# Altium schematic sheet Audio_Codec_Analog_FrontEnd.SchDoc
size 558 x 330 mm; SheetNumber: 1; SheetTotal: 3
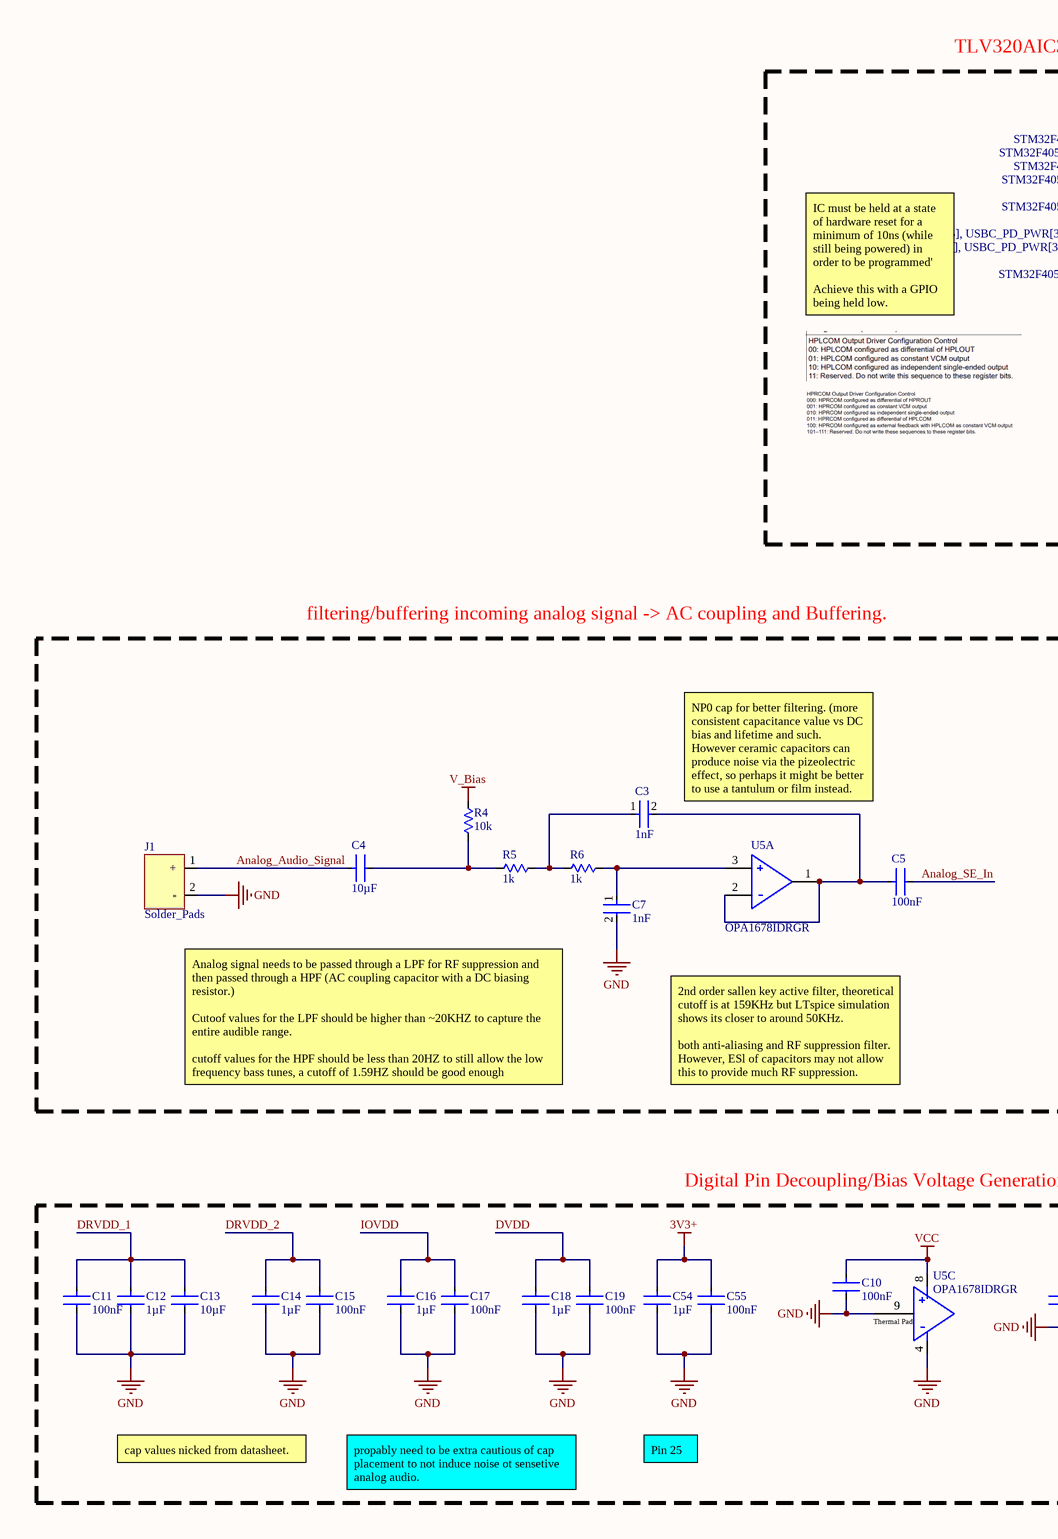
[diagram p0: Audio_Codec_Analog_FrontEnd.SchDoc, left]
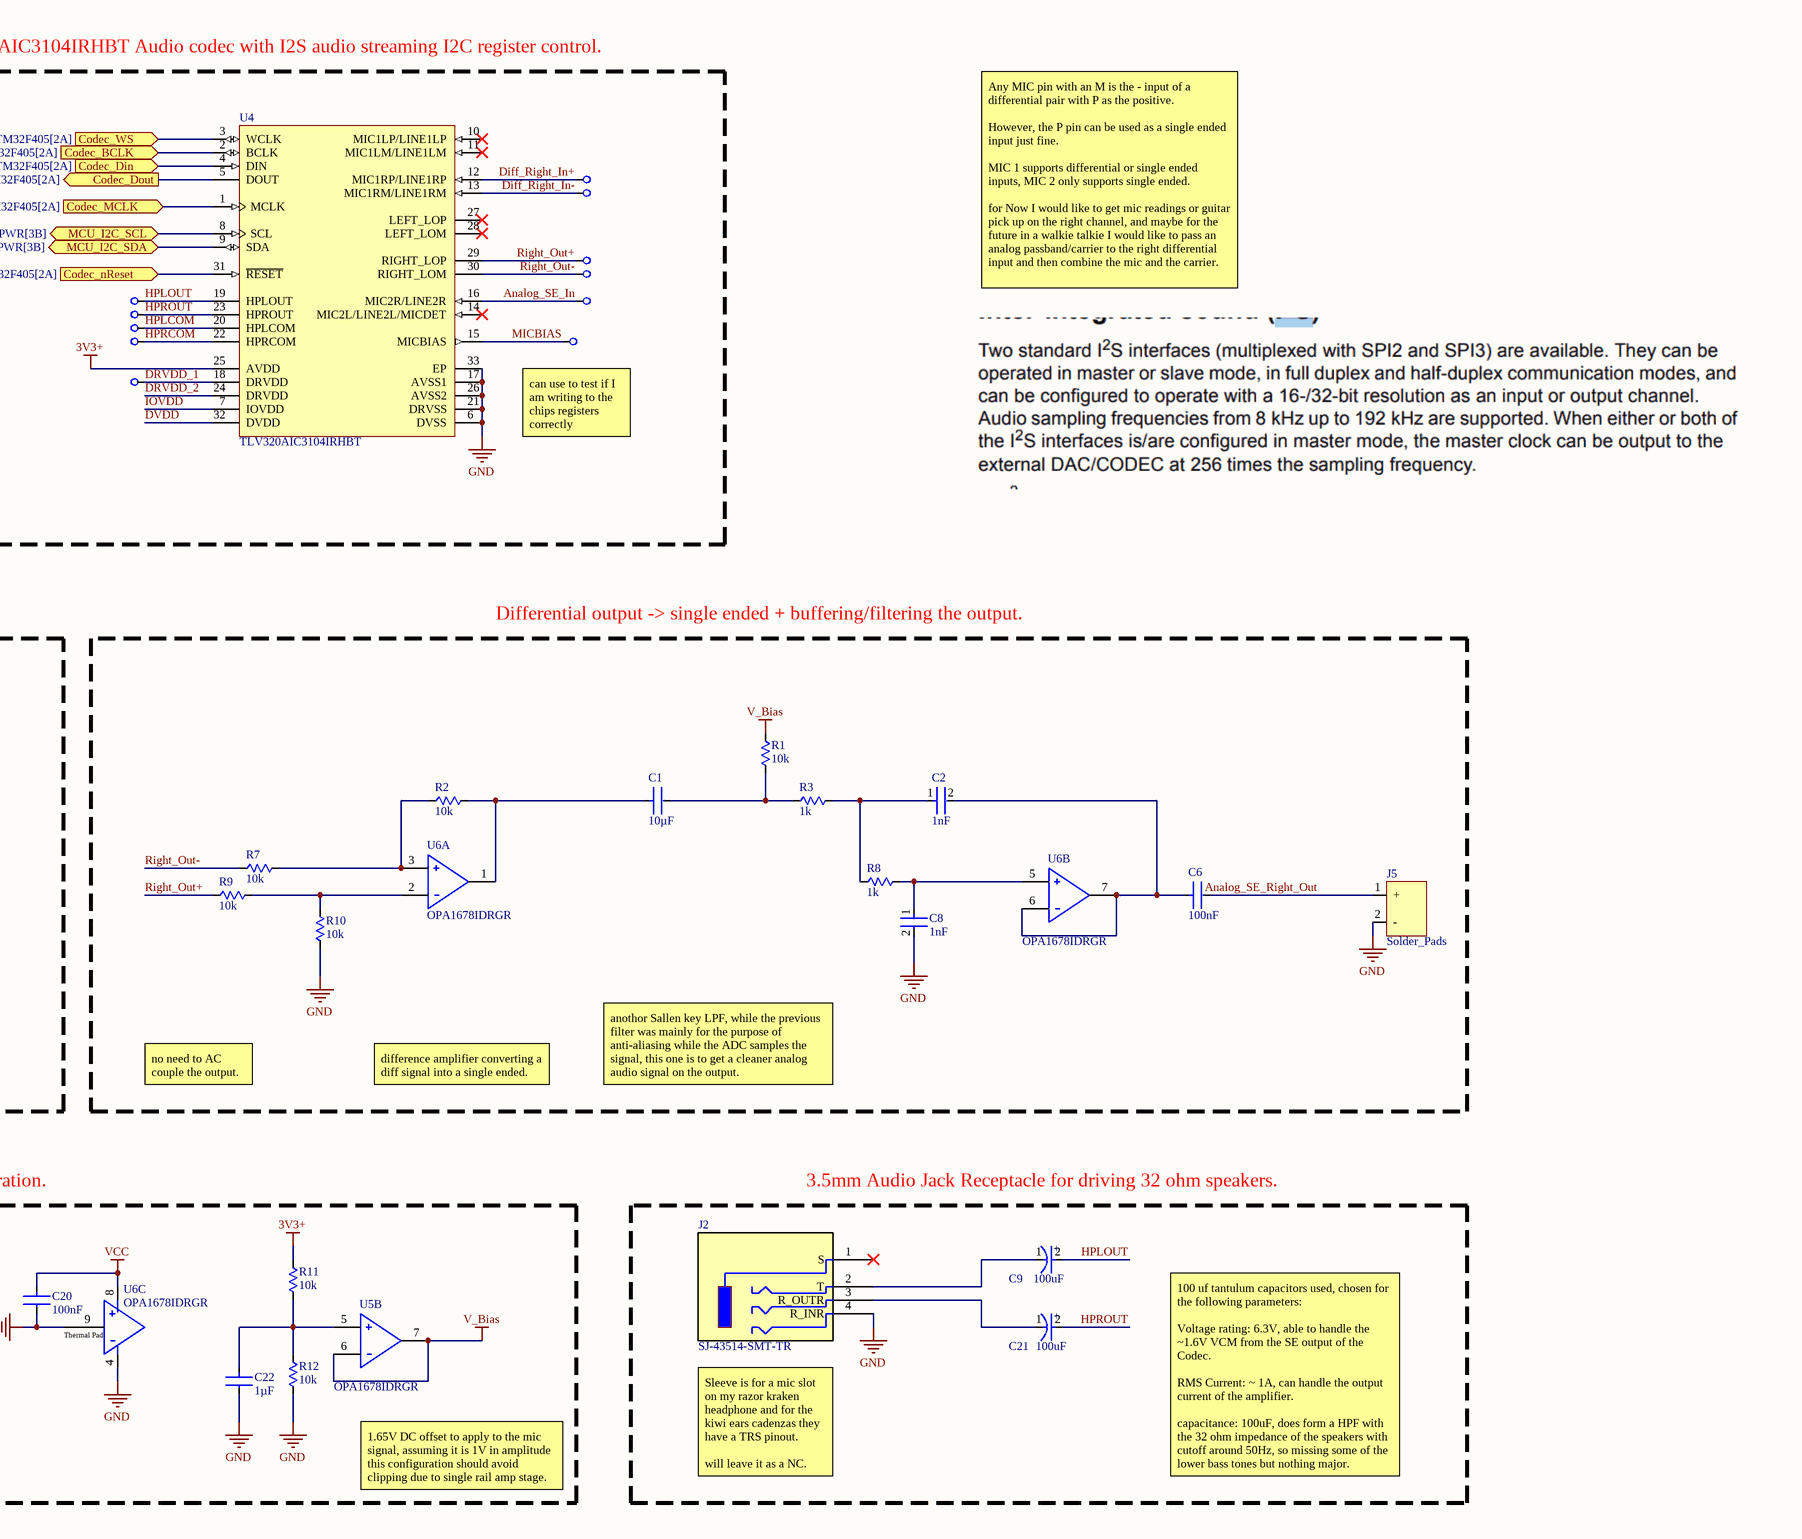
[diagram p1: Audio_Codec_Analog_FrontEnd.SchDoc, right]

## Parts
C1  value 10µF  [MURATA-G_M21B]  (hidden comment: GCM21BC71E106KE36L)
C2  1nF  [FP-GRM188-0_1-e0_2_0_5-IPC_C]
C3  1nF  [FP-GRM188-0_1-e0_2_0_5-IPC_C]
C4  value 10µF  [MURATA-G_M21B]  (hidden comment: GCM21BC71E106KE36L)
C5  value 100nF  [MURATA-G_M188]  (hidden comment: GCM188R71H104KA57D)
C6  value 100nF  [MURATA-G_M188]  (hidden comment: GCM188R71H104KA57D)
C7  1nF  [FP-GRM188-0_1-e0_2_0_5-IPC_C]
C8  1nF  [FP-GRM188-0_1-e0_2_0_5-IPC_C]
C9  Capacitance: 100uF  [FP-TAJB-MFG]  (hidden comment: TAJB107M006RNJ)
C10  value 100nF  [MURATA-G_M188]  (hidden comment: GCM188R71H104KA57D)
C11  value 100nF  [MURATA-G_M188]  (hidden comment: GCM188R71H104KA57D)
C12  value 1µF  [MURATA-G_M188]  (hidden comment: GCM188R71E105KA64D)
C13  value 10µF  [MURATA-G_M21B]  (hidden comment: GCM21BC71E106KE36L)
C14  value 1µF  [MURATA-G_M188]  (hidden comment: GCM188R71E105KA64D)
C15  value 100nF  [MURATA-G_M188]  (hidden comment: GCM188R71H104KA57D)
C16  value 1µF  [MURATA-G_M188]  (hidden comment: GCM188R71E105KA64D)
C17  value 100nF  [MURATA-G_M188]  (hidden comment: GCM188R71H104KA57D)
C18  value 1µF  [MURATA-G_M188]  (hidden comment: GCM188R71E105KA64D)
C19  value 100nF  [MURATA-G_M188]  (hidden comment: GCM188R71H104KA57D)
C20  value 100nF  [MURATA-G_M188]  (hidden comment: GCM188R71H104KA57D)
C21  Capacitance: 100uF  [FP-TAJB-MFG]  (hidden comment: TAJB107M006RNJ)
C22  value 1µF  [MURATA-G_M188]  (hidden comment: GCM188R71E105KA64D)
C54  value 1µF  [MURATA-G_M188]  (hidden comment: GCM188R71E105KA64D)
C55  value 100nF  [MURATA-G_M188]  (hidden comment: GCM188R71H104KA57D)
J1  Solder_Pads  [2_soldering_pads]
J2  SJ-43514-SMT-TR  [SJ-43514-SMT_CUD]
J5  Solder_Pads  [2_soldering_pads]
R1  value 10k  [VISHAY-CRCW0603]  (hidden comment: CRCW060310K0FKTA)
R2  value 10k  [VISHAY-CRCW0603]  (hidden comment: CRCW060310K0FKTA)
R3  value 1k  [VISHAY-TNPW0603]  (hidden comment: TNPW06031K00BEEA)
R4  value 10k  [VISHAY-CRCW0603]  (hidden comment: CRCW060310K0FKTA)
R5  value 1k  [VISHAY-TNPW0603]  (hidden comment: TNPW06031K00BEEA)
R6  value 1k  [VISHAY-TNPW0603]  (hidden comment: TNPW06031K00BEEA)
R7  value 10k  [VISHAY-CRCW0603]  (hidden comment: CRCW060310K0FKTA)
R8  value 1k  [VISHAY-TNPW0603]  (hidden comment: TNPW06031K00BEEA)
R9  value 10k  [VISHAY-CRCW0603]  (hidden comment: CRCW060310K0FKTA)
R10  value 10k  [VISHAY-CRCW0603]  (hidden comment: CRCW060310K0FKTA)
R11  value 10k  [VISHAY-CRCW0603]  (hidden comment: CRCW060310K0FKTA)
R12  value 10k  [VISHAY-CRCW0603]  (hidden comment: CRCW060310K0FKTA)
TP1  Testpoint 1mm  [Testpoint 1mm]  (value not drawn)
TP2  Testpoint 1mm  [Testpoint 1mm]  (value not drawn)
TP3  Testpoint 1mm  [Testpoint 1mm]  (value not drawn)
TP4  Testpoint 1mm  [Testpoint 1mm]  (value not drawn)
TP5  Testpoint 1mm  [Testpoint 1mm]  (value not drawn)
TP6  Testpoint 1mm  [Testpoint 1mm]  (value not drawn)
TP7  Testpoint 1mm  [Testpoint 1mm]  (value not drawn)
TP8  Testpoint 1mm  [Testpoint 1mm]  (value not drawn)
TP9  Testpoint 1mm  [Testpoint 1mm]  (value not drawn)
TP25  Testpoint 1mm  [Testpoint 1mm]  (value not drawn)
TP26  Testpoint 1mm  [Testpoint 1mm]  (value not drawn)
U4  TLV320AIC3104IRHBT  [RHB0032E_V]
U5  OPA1678IDRGR  [FP-DRG0008A-IPC_B]  (parts A,B,C of 3)
U6  OPA1678IDRGR  [FP-DRG0008A-IPC_B]  (parts A,B,C of 3)

## Blocks framed on the sheet
Digital Pin Decoupling/Bias Voltage Generation.: C10-C20 C22 C54 C55 R11 R12 U5 U6
3.5mm Audio Jack Receptacle for driving 32 ohm speakers.: C9 C21 J2

## Ports
Codec_BCLK (in, see STM32F405[2A]), Codec_Din (in, see STM32F405[2A]), Codec_Dout (out, see STM32F405[2A]), Codec_MCLK (in, see STM32F405[2A]), Codec_nReset (in, see STM32F405[2A]), Codec_WS (in, see STM32F405[2A]), MCU_I2C_SCL (bidir, see STM32F405[2B], USBC_PD_PWR[3B]), MCU_I2C_SDA (bidir, see STM32F405[2B], USBC_PD_PWR[3B])

## Nets
3V3+: C54.1 C55.1 R11.2 U4.25(AVDD)
GND: C7.2 C8.2 C10.2 C11.2 C12.2 C13.2 C14.2 C15.2 C16.2 C17.2 C18.2 C19.2 C20.2 C22.2 C54.2 C55.2 J1.2(-) J2.4(R_INR) J5.2(-) R10.2 R12.1 U4.6(DVSS) U4.17(AVSS1) U4.21(DRVSS) U4.26(AVSS2) U4.33(EP) U5.4(OUT_B) U5.9(Thermal_Pad) U6.4(OUT_B) U6.9(Thermal_Pad)
V_Bias: R1.2 R4.2 U5.6(-IN_B) U5.7(OUT_B)
VCC: C10.1 C20.1 U5.8(OUT_B) U6.8(OUT_B)
Analog_Audio_Signal: C4.1 J1.1(+)
Analog_SE_In: C5.2 TP6.1 U4.16(MIC2R/LINE2R)
Analog_SE_Right_Out: C6.2 J5.1(+)
Codec_BCLK: U4.2(BCLK) ; port Codec_BCLK
Codec_Din: U4.4(DIN) ; port Codec_Din
Codec_Dout: U4.5(DOUT) ; port Codec_Dout
Codec_MCLK: U4.1(MCLK) ; port Codec_MCLK
Codec_nReset: U4.31(~{RESET}) ; port Codec_nReset
Codec_WS: U4.3(WCLK) ; port Codec_WS
Diff_Right_In+: TP1.1 U4.12(MIC1RP/LINE1RP)
Diff_Right_In-: TP2.1 U4.13(MIC1RM/LINE1RM)
DRVDD_1: C11.1 C12.1 C13.1 TP9.1 U4.18(DRVDD)
DRVDD_2: C14.1 C15.1 U4.24(DRVDD)
DVDD: C18.1 C19.1 U4.32(DVDD)
HPLCOM: TP25.1 U4.20(HPLCOM)
HPLOUT: C9.2(A) TP5.1 U4.19(HPLOUT)
HPRCOM: TP26.1 U4.22(HPRCOM)
HPROUT: C21.2(A) TP7.1 U4.23(HPROUT)
IOVDD: C16.1 C17.1 U4.7(IOVDD)
MCU_I2C_SCL: U4.8(SCL) ; port MCU_I2C_SCL
MCU_I2C_SDA: U4.9(SDA) ; port MCU_I2C_SDA
MICBIAS: TP8.1 U4.15(MICBIAS)
Right_Out+: R9.2 TP3.1 U4.29(RIGHT_LOP)
Right_Out-: R7.2 TP4.1 U4.30(RIGHT_LOM)
NetC1_1: C1.1 R2.1 U6.1(OUT_B)
NetC1_2: C1.2 R1.1 R3.2
NetC2_1: C2.1 R3.1 R8.2
NetC2_2: C2.2 C6.1 U6.6(-IN_B) U6.7(OUT_B)
NetC3_1: C3.1 R5.1 R6.2
NetC3_2: C3.2 C5.1 U5.1(OUT_B) U5.2(-IN_B)
NetC4_2: C4.2 R4.1 R5.2
NetC7_1: C7.1 R6.1 U5.3(+IN_B)
NetC8_1: C8.1 R8.1 U6.5(+IN_B)
NetC9_1: C9.1(C) J2.2(T)
NetC21_1: C21.1(C) J2.3(R_OUTR)
NetC22_1: C22.1 R11.1 R12.2 U5.5(+IN_B)
NetR2_2: R2.2 R7.1 U6.3(+IN_B)
NetR9_1: R9.1 R10.1 U6.2(-IN_B)

Not connected (* = marked no-connect by the designer): J2 1(S)*; U4 10(MIC1LP/LINE1LP)* 11(MIC1LM/LINE1LM)* 14(MIC2L/LINE2L/MICDET)* 27(LEFT_LOP)* 28(LEFT_LOM)*

## Notes on the sheet
- TLV320AIC3104IRHBT Audio codec with I2S audio streaming I2C register control.
- IC must be held at a state of hardware reset for a minimum of 10ns (while still being powered) in order to be programmed'
  Achieve this with a GPIO being held low.
- Any MIC pin with an M is the - input of a differential pair with P as the positive.
  However, the P pin can be used as a single ended input just fine.
  MIC 1 supports differential or single ended inputs, MIC 2 only supports single ended.
  for Now I would like to get mic readings or guitar pick up on the right channel, and maybe for the future in a walkie talkie I would like to pass an analog passband/carrier to the right differential input and then combine the mic and the carrier.
- (near TP8) can use to test if I am writing to the chips registers correctly
- filtering/buffering incoming analog signal -> AC coupling and Buffering.
- Differential output -> single ended + buffering/filtering the output.
- (near C3) NP0 cap for better filtering. (more consistent capacitance value vs DC bias and lifetime and such.
  However ceramic capacitors can produce noise via the pizeolectric effect, so perhaps it might be better to use a tantulum or film instead.
- Analog signal needs to be passed through a LPF for RF suppression and then passed through a HPF (AC coupling capacitor with a DC biasing resistor.)
  Cutoof values for the LPF should be higher than ~20KHZ to capture the entire audible range.
  cutoff values for the HPF should be less than 20HZ to still allow the low frequency bass tunes, a cutoff of 1.59HZ should be good enough
- 2nd order sallen key active filter, theoretical cutoff is at 159KHz but LTspice simulation shows its closer to around 50KHz.
  both anti-aliasing and RF suppression filter. However, ESl of capacitors may not allow this to provide much RF suppression.
- no need to AC couple the output.
- difference amplifier converting a diff signal into a single ended.
- anothor Sallen key LPF, while the previous filter was mainly for the purpose of anti-aliasing while the ADC samples the signal, this one is to get a cleaner analog audio signal on the output.
- cap values nicked from datasheet.
- Pin 25
- propably need to be extra cautious of cap placement to not induce noise ot sensetive analog audio.
- 1.65V DC offset to apply to the mic signal, assuming it is 1V in amplitude this configuration should avoid clipping due to single rail amp stage.
- Sleeve is for a mic slot on my razor kraken headphone and for the kiwi ears cadenzas they have a TRS pinout.
  will leave it as a NC.
- 100 uf tantulum capacitors used, chosen for the following parameters:
  Voltage rating: 6.3V, able to handle the ~1.6V VCM from the SE output of the Codec.
  RMS Current: ~ 1A, can handle the output current of the amplifier.
  capacitance: 100uF, does form a HPF with the 32 ohm impedance of the speakers with cutoff around 50Hz, so missing some of the lower bass tones but nothing major.
- (in symbol CMP-04424-000592-1) +
- (in symbol CMP-04894-000047-1, part C) Thermal Pad

## Library data of the parts
C1 C4 C13 = CMP-001-02049-3: 10 µF ±10% 25V Ceramic Capacitor X7S 0805 (2012 Metric); Capacitor Type: Ceramic; Mounting Technology: Surface Mount; Min Operating Temperature: 125°C; Case/Package: 0805; Voltage Rating: 25V; Temperature Code: X7S; Tolerance: 10%; Pins: 2; Max Operating Temperature: -55°C
C2 C3 C7 C8 = CMP-1662-00022-2: Chip Multilayer Ceramic Capacitors for General Purpose, 0603, 1000pF, C0G, 30ppm/°C, 5%, 50V; Insulation Resistance: 10GR; Number of Pins: 2; REACH SVHC: No SVHC; Width: 0.8mm; Tolerance: 5%; Termination: SMD/SMT; Thickness: 0.035inch; Height: 0.8mm; Case Code (Imperial): 0603; Length: 1.6mm; Voltage Rating: 50V; Voltage Rating (DC): 50V; Temperature Coefficient: 30ppm/°C; Capacitance: 1nF; Mount: Surface Mount; Lead Free: Lead Free; Max Operating Temperature: 125°C; Min Operating Temperature: -55°C; Packaging: Tape and Reel; Dielectric: C0G; Voltage: 50V; Package Quantity: 1; Material: Ceramic; Case Code (Metric): 1608; Radiation Hardening: No; Depth: 0.8mm; Case/Package: 0603; Dielectric Material: Ceramic
C5 C6 C10 C11 C15 C17 C19 C20 C55 = CMP-001-00243-4: 0.1 µF ±10% 50V Ceramic Capacitor X7R 0603 (1608 Metric); Pins: 2; Temperature Code: X7R; Mounting Technology: Surface Mount; Capacitor Type: Ceramic; Case/Package: 0603; RoHS Compliant: Yes; Tolerance: 10%; Voltage Rating: 50V
C9 C21 = CMP-04424-000592-1: 100uF 6.3V  ±20% 1.7Ω 1210  SMD Tantalum Capacitor; ESR (Equivalent Series Resistance): 1.7R; Leakage Current: 6.3uA; Polarity: Polar; Dissipation Factor: 10%; Termination: SMD/SMT; Max Operating Temperature: 125°C; RoHS Compliant: Yes; Features: General Purpose; Voltage Rating (DC): 6.3V; Width: 2.8mm; Construction: Flat; Length: 3.5mm; Height: 2.1mm; Min Operating Temperature: -55°C; Tolerance: 20%; Lead Free: Lead Free; Mount: Surface Mount; Voltage Rating: 6.3V; Package Quantity: 1; Packaging: Tape and Reel; Case/Package: 1210; Case Code (Imperial): 1210; Depth: 2.8mm; Case Code (Metric): 3528; Series: TAJ; Number of Pins: 2; REACH SVHC: No SVHC; Radiation Hardening: No; Height - Seated (Max): 0.083inch
C12 C14 C16 C18 C22 C54 = CMP-001-00230-4: 1 µF ±10% 25V Ceramic Capacitor X7R 0603 (1608 Metric); Tolerance: 10%; Mounting Technology: Surface Mount; Temperature Code: X7R; Case/Package: 0603; RoHS Compliant: Yes; Pins: 2; Capacitor Type: Ceramic; Voltage Rating: 25V
J2 = SJ-43514-SMT-TR: Description; Manufacturer_Name: Same Sky; Copyright: Copyright (C) 2025 Ultra Librarian. All rights reserved.; Manufacturer_Part_Number: SJ-43514-SMT-TR; RefDes: RefDes; Type: Type
R1 R2 R4 R7 R9-R12 = CMP-009-00002-7: 10 kOhms ±1% 0.1W, 1/10W Chip Resistor 0603 (1608 Metric) Automotive AEC-Q200 Thick Film; Power: 100mW; Voltage Rating: 75V; Max Operating Temperature: 155°C; Pins: 2; Min Operating Temperature: -55°C; RoHS Compliant: No; Tolerance: 1%; Case/Package: 0603; Mounting Technology: Surface Mount
R3 R5 R6 R8 = CMP-009-00212-3: 1 kOhms ±0.1% 0.21W Chip Resistor 0603 (1608 Metric) Anti-Sulfur, Automotive AEC-Q200, Moisture Resistant Thin Film; Voltage Rating: 100V; Power: 100mW; Pins: 2; Mounting Technology: Surface Mount; Tolerance: 0.1%; Case/Package: 0603; Max Operating Temperature: 125°C; RoHS Compliant: Yes; Min Operating Temperature: -55°C
TP1-TP9 TP25 TP26 = CMP-00030-00004-4: Labelled 1mm testpoint pad
U4 = CMP-0331-00065-2: Low-Power Stereo CODEC with 6 Inputs, 6 Outputs, HP Amp and Enhanced Digital Effects, 2 ADCs and 2 DACs, 102 dB DAC SNR, -40 to 85 degC, 32-pin QFN (RHB), Green (RoHS & no Sb/Br); Manufacturer: Texas Instruments; # DACs: 2; Digital Audio Interfaces: L, R, I2S, DSP, TDM; Additional Features: LP Bypass, Notch Filtering, 3D, EQ, Matrix Mixing, PLL; Sampling Rate (Max) (kHz): 96; DAC SNR: 102; Control Interface: I2C; Battery Powered: TRUE; PartNumber: TLV320AIC3104IRHBT; DatasheetVersion: SLAS510C; Code_JEDEC: MO-220; ComponentLink1Description: Datasheet; PackageDescription: 32-Pin Plastic Quad Flat No-Lead, 5 x 5 mm Body, 0.5 mm Pitch, 3.45 x 3.45 mm Exposed Pad; ComponentLink1URL: http://www.ti.com/general/docs/lit/getliterature.tsp?genericPartNumber=TLV320AIC3104&fileType=pdf; # ADCs (typ): 2; Mounting Technology: Surface Mount; PackageVersion: revD, Jun-2011; PackageReference: RHB0032E
U5 U6 = CMP-04894-000047-1: IC AUDIO 2 CIRCUIT 8SON; Input Bias Current: 10pA; Input Offset Voltage (Vos): 500uV; Number of Circuits: 2; Operating Supply Current: 2mA; Slew Rate: 9V/µs; Gain Bandwidth Product: 16MHz; Min Operating Temperature: -40°C; Max Operating Temperature: 85°C; RoHS Compliant: Yes; Mount: Surface Mount; Packaging: Cut Tape; Number of Channels: 2